# Altium project Clock.PrjPcb
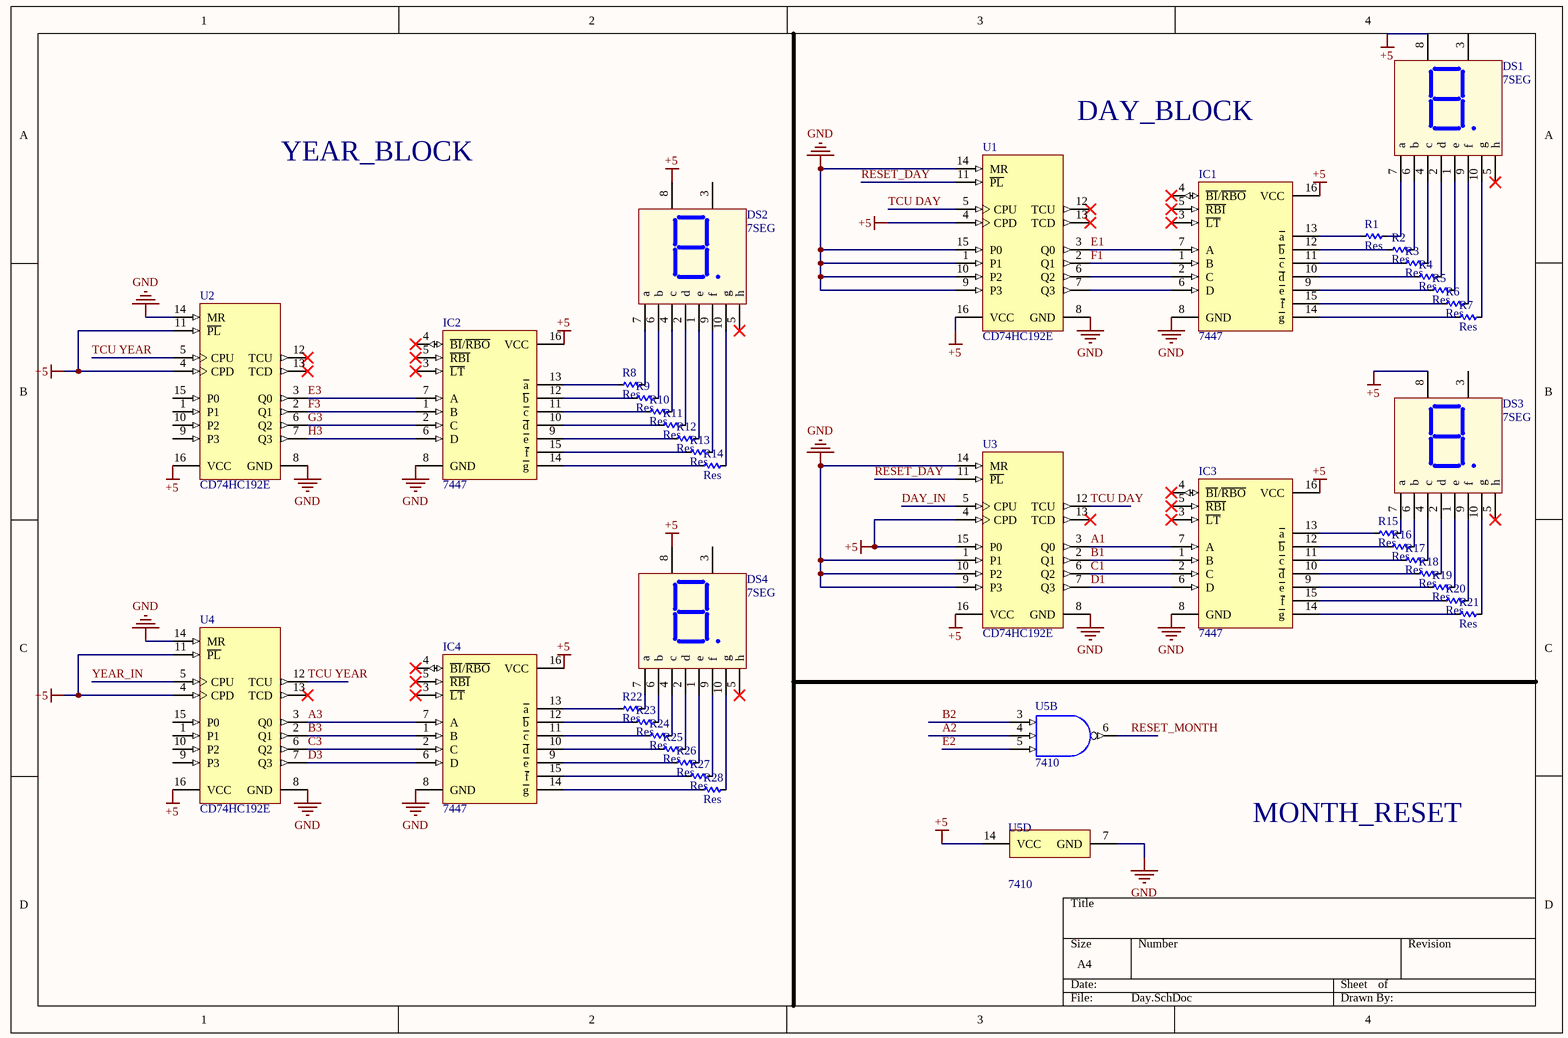
[diagram p0: Day.SchDoc]
3 sheets, 84 parts. Net scope: global (net labels, ports and power ports of the same name join across sheets).
Board file: Clock_pcb.PcbDoc
Sheets:
  Day.SchDoc
  SCH_RESETDAY.SchDoc
  Month.SchDoc

## Sheet Day.SchDoc
size A4; SheetNumber: 1; SheetTotal: 3

### Parts
DS1  7SEG  [LED7SEG-1-0.56]
DS2  7SEG  [LED7SEG-1-0.56]
DS3  7SEG  [LED7SEG-1-0.56]
DS4  7SEG  [LED7SEG-1-0.56]
IC1  7447  [DIP16]
IC2  7447  [DIP16]
IC3  7447  [DIP16]
IC4  7447  [DIP16]
R1  Res  [RES-1/4W]
R2  Res  [RES-1/4W]
R3  Res  [RES-1/4W]
R4  Res  [RES-1/4W]
R5  Res  [RES-1/4W]
R6  Res  [RES-1/4W]
R7  Res  [RES-1/4W]
R8  Res  [RES-1/4W]
R9  Res  [RES-1/4W]
R10  Res  [RES-1/4W]
R11  Res  [RES-1/4W]
R12  Res  [RES-1/4W]
R13  Res  [RES-1/4W]
R14  Res  [RES-1/4W]
R15  Res  [RES-1/4W]
R16  Res  [RES-1/4W]
R17  Res  [RES-1/4W]
R18  Res  [RES-1/4W]
R19  Res  [RES-1/4W]
R20  Res  [RES-1/4W]
R21  Res  [RES-1/4W]
R22  Res  [RES-1/4W]
R23  Res  [RES-1/4W]
R24  Res  [RES-1/4W]
R25  Res  [RES-1/4W]
R26  Res  [RES-1/4W]
R27  Res  [RES-1/4W]
R28  Res  [RES-1/4W]
U1  CD74HC192E  [N0016A]
U2  CD74HC192E  [N0016A]
U3  CD74HC192E  [N0016A]
U4  CD74HC192E  [N0016A]
U5  7410  [N0014A]  (parts B,D of 4)

### Nets
+5: DS1.8(Vcc) DS2.8(Vcc) DS3.8(Vcc) DS4.8(Vcc) IC1.16(VCC) IC2.16(VCC) IC3.16(VCC) IC4.16(VCC) U1.4(CPD) U1.16(VCC) U2.4(CPD) U2.11(~{PL}) U2.16(VCC) U3.4(CPD) U3.15(P0) U3.16(VCC) U4.4(CPD) U4.11(~{PL}) U4.16(VCC) U5.14(VCC)
GND: IC1.8(GND) IC2.8(GND) IC3.8(GND) IC4.8(GND) U1.1(P1) U1.8(GND) U1.9(P3) U1.10(P2) U1.14(MR) U1.15(P0) U2.8(GND) U2.14(MR) U3.1(P1) U3.8(GND) U3.9(P3) U3.10(P2) U3.14(MR) U4.8(GND) U4.14(MR) U5.7(GND)
A1: IC3.7(A) U3.3(Q0)
A2: U5.4(2B)
A3: IC4.7(A) U4.3(Q0)
B1: IC3.1(B) U3.2(Q1)
B2: U5.3(2A)
B3: IC4.1(B) U4.2(Q1)
C1: IC3.2(C) U3.6(Q2)
C3: IC4.2(C) U4.6(Q2)
D1: IC3.6(D) U3.7(Q3)
D3: IC4.6(D) U4.7(Q3)
DAY_IN: U3.5(CPU)
E1: IC1.7(A) U1.3(Q0)
E2: U5.5(2C)
E3: IC2.7(A) U2.3(Q0)
F1: IC1.1(B) U1.2(Q1)
F3: IC2.1(B) U2.2(Q1)
G3: IC2.2(C) U2.6(Q2)
H3: IC2.6(D) U2.7(Q3)
RESET_DAY: U1.11(~{PL}) U3.11(~{PL})
RESET_MONTH: U5.6(2Y)
TCU DAY: U1.5(CPU) U3.12(TCU)
TCU YEAR: U2.5(CPU) U4.12(TCU)
YEAR_IN: U4.5(CPU)
NetDS1_1: DS1.1(e) R5.1
NetDS1_2: DS1.2(d) R4.1
NetDS1_4: DS1.4(c) R3.1
NetDS1_6: DS1.6(b) R2.1
NetDS1_7: DS1.7(a) R1.1
NetDS1_9: DS1.9(f) R6.1
NetDS1_10: DS1.10(g) R7.1
NetDS2_1: DS2.1(e) R12.1
NetDS2_2: DS2.2(d) R11.1
NetDS2_4: DS2.4(c) R10.1
NetDS2_6: DS2.6(b) R9.1
NetDS2_7: DS2.7(a) R8.1
NetDS2_9: DS2.9(f) R13.1
NetDS2_10: DS2.10(g) R14.1
NetDS3_1: DS3.1(e) R19.1
NetDS3_2: DS3.2(d) R18.1
NetDS3_4: DS3.4(c) R17.1
NetDS3_6: DS3.6(b) R16.1
NetDS3_7: DS3.7(a) R15.1
NetDS3_9: DS3.9(f) R20.1
NetDS3_10: DS3.10(g) R21.1
NetDS4_1: DS4.1(e) R26.1
NetDS4_2: DS4.2(d) R25.1
NetDS4_4: DS4.4(c) R24.1
NetDS4_6: DS4.6(b) R23.1
NetDS4_7: DS4.7(a) R22.1
NetDS4_9: DS4.9(f) R27.1
NetDS4_10: DS4.10(g) R28.1
NetIC1_2: IC1.2(C) U1.6(Q2)
NetIC1_6: IC1.6(D) U1.7(Q3)
NetIC1_9: IC1.9(~{e}) R5.2
NetIC1_10: IC1.10(~{d}) R4.2
NetIC1_11: IC1.11(~{c}) R3.2
NetIC1_12: IC1.12(~{b}) R2.2
NetIC1_13: IC1.13(~{a}) R1.2
NetIC1_14: IC1.14(~{g}) R7.2
NetIC1_15: IC1.15(~{f}) R6.2
NetIC2_9: IC2.9(~{e}) R12.2
NetIC2_10: IC2.10(~{d}) R11.2
NetIC2_11: IC2.11(~{c}) R10.2
NetIC2_12: IC2.12(~{b}) R9.2
NetIC2_13: IC2.13(~{a}) R8.2
NetIC2_14: IC2.14(~{g}) R14.2
NetIC2_15: IC2.15(~{f}) R13.2
NetIC3_9: IC3.9(~{e}) R19.2
NetIC3_10: IC3.10(~{d}) R18.2
NetIC3_11: IC3.11(~{c}) R17.2
NetIC3_12: IC3.12(~{b}) R16.2
NetIC3_13: IC3.13(~{a}) R15.2
NetIC3_14: IC3.14(~{g}) R21.2
NetIC3_15: IC3.15(~{f}) R20.2
NetIC4_9: IC4.9(~{e}) R26.2
NetIC4_10: IC4.10(~{d}) R25.2
NetIC4_11: IC4.11(~{c}) R24.2
NetIC4_12: IC4.12(~{b}) R23.2
NetIC4_13: IC4.13(~{a}) R22.2
NetIC4_14: IC4.14(~{g}) R28.2
NetIC4_15: IC4.15(~{f}) R27.2

Not connected (* = marked no-connect by the designer): DS1 3(Vcc) 5(h)*; DS2 3(Vcc) 5(h)*; DS3 3(Vcc) 5(h)*; DS4 3(Vcc) 5(h)*; IC1 3(~{LT})* 4(~{BI}/~{RBO})* 5(~{RBI})*; IC2 3(~{LT})* 4(~{BI}/~{RBO})* 5(~{RBI})*; IC3 3(~{LT})* 4(~{BI}/~{RBO})* 5(~{RBI})*; IC4 3(~{LT})* 4(~{BI}/~{RBO})* 5(~{RBI})*; U1 12(TCU)* 13(TCD)*; U2 1(P1) 9(P3) 10(P2) 12(TCU)* 13(TCD)* 15(P0); U3 13(TCD)*; U4 1(P1) 9(P3) 10(P2) 13(TCD)* 15(P0)

### Notes on the sheet
- YEAR_BLOCK
- DAY_BLOCK
- MONTH_RESET

### Library data of the parts
DS1-DS4 = LED7SEG-1: 14.2 mm General Purpose Blue 7-Segment Display: CC, RH DP, Gray Surface; MinimumIntensity: 2020 ucd; Note: IF = 10 mA; Published: 8-Jun-2000; LatestRevisionDate: 17-Dec-2003; LatestRevisionNote: Schematic revised, PCB Footprint replaced.; DatasheetDocument: 24-Sep-2002; PackageDocument: 24-Sep-2002; PackageReference: H; Publisher: Altium Limited; Colour: Blue; ComponentLink1Description: Manufacturer Link; ComponentLink1URL: http://www.agilent.com/
IC1-IC4 = 7447: BCD to 7-Segment Decoder/Driver; Value: 7447 , 74247
R1-R28 = Res: Manufacturer: Generic Components; Class: Passive; SubClass: R; Published: 08/06/2000; Publisher: Altium Hobart Technology Centre
U1-U4 = 74192: High Speed CMOS Logic Presettable Synchronous BCD Decade Up/Down Counter with Asynchronous Reset, N0016A, TUBE; Manufacturer: Texas Instruments; Output Drive (IOL/IOH)(Max)(mA): 5.2/-5.2; Inputs: 1; VCC(Min)(V): 2; ICC @ Nom Voltage(Max)(mA): 0.08; Input Type: LVTTL/CMOS; Technology Family: HC; F @ Nom Voltage(Max)(Mhz): 28; VCC(Max)(V): 6; Bits(#): 4; Rating: Catalog; tpd @ Nom Voltage(Max)(ns): 46; Voltage(Nom)(V): 3.3,5; Schmitt Trigger: No; PackageReference: N0016A; Code_JEDEC: MS-001; Generic Part Number: CD74HC192; Type: Decade; DatasheetVersion: SCHS163F; Operating Temperature Range(C): -55 to 125; Function: Counter; Output Type: CMOS
U5 = 7410: Triple 3-input positive-NAND gates, N0014A, TUBE; Manufacturer: Texas Instruments; Generic Part Number: SN74F10; Input Type: TTL; F @ Nom Voltage(Max)(Mhz): 70; Schmitt Trigger: No; tpd @ Nom Voltage(Max)(ns): 6; Bits(#): 3; Rating: Catalog; VCC(Max)(V): 5.5; ICC @ Nom Voltage(Max)(mA): 0.0077; Output Drive (IOL/IOH)(Max)(mA): 1/-20; Technology Family: F; VCC(Min)(V): 4.5; Voltage(Nom)(V): 5; DatasheetVersion: SDFS039A; Output Type: TTL; Code_JEDEC: MS-001; Operating Temperature Range(C): 0 to 70; PackageReference: N0014A

## Sheet SCH_RESETDAY.SchDoc
size A4; SheetNumber: 2; SheetTotal: 3
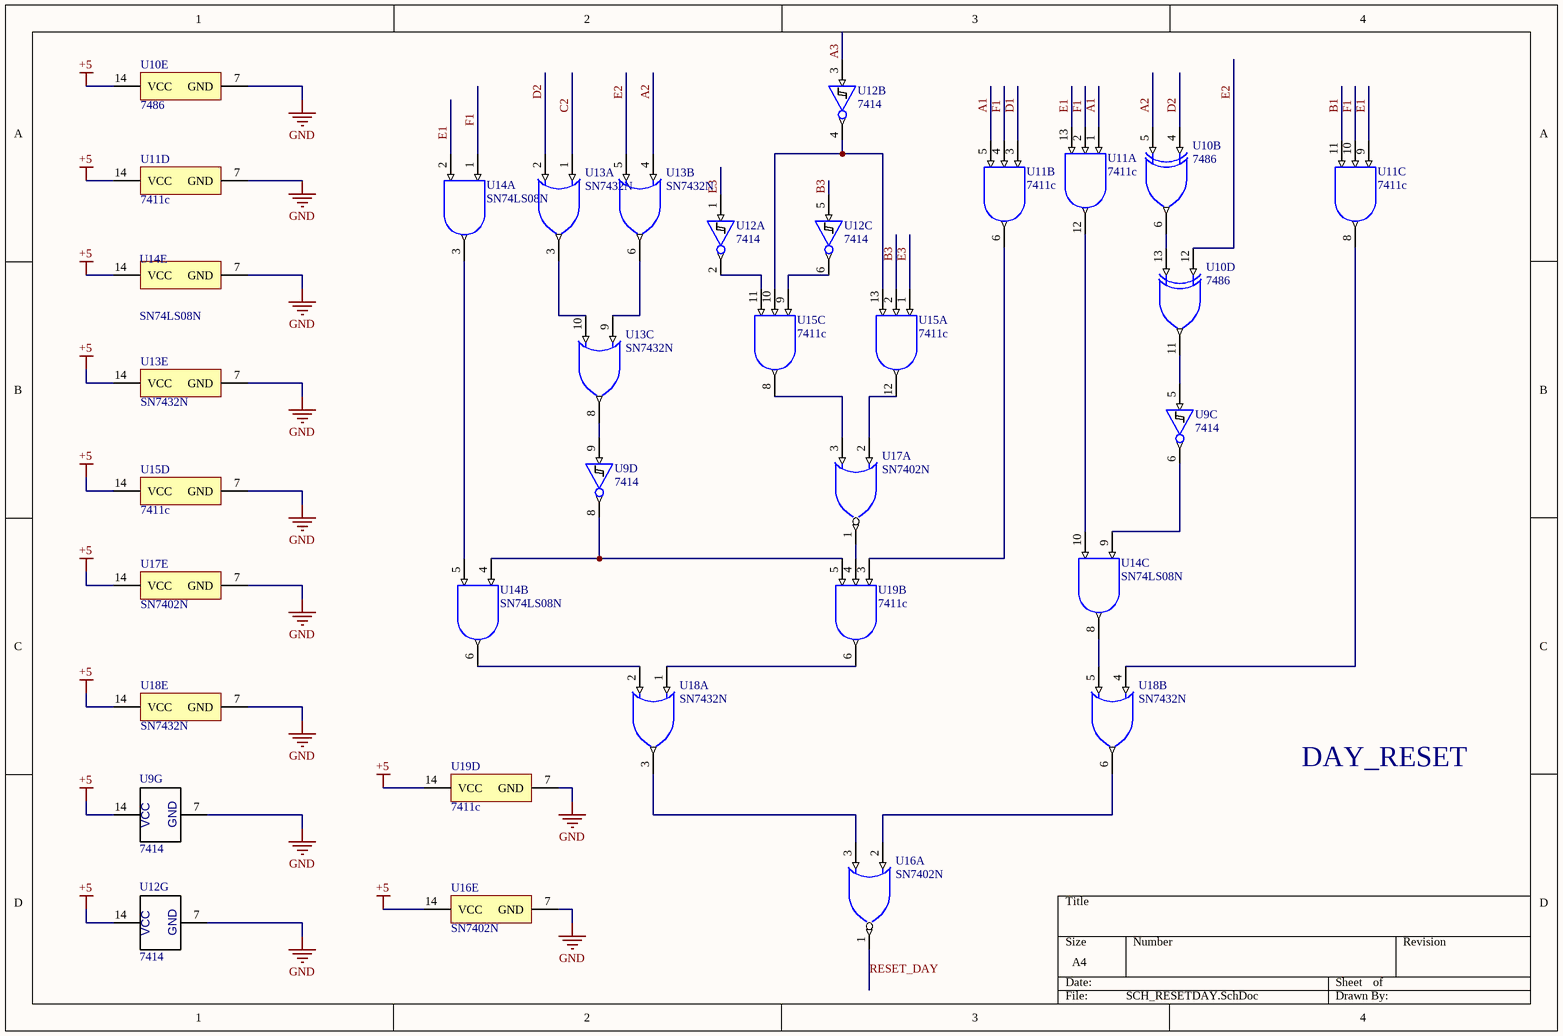
[diagram p1: SCH_RESETDAY.SchDoc]

### Parts
U9  7414  [DIP14]  (parts C,D,G of 7)
U10  7486  [N0014A]  (parts B,D,E of 5)
U11  7411c  [N0014A]  (parts A,B,C,D of 4)
U12  7414  [DIP14]  (parts A,B,C,G of 7)
U13  SN7432N  [N0014A]  (parts A,B,C,E of 5)
U14  SN74LS08N  [N0014A]  (parts A,B,C,E of 5)
U15  7411c  [N0014A]  (parts A,C,D of 4)
U16  SN7402N  [N0014A]  (parts A,E of 5)
U17  SN7402N  [N0014A]  (parts A,E of 5)
U18  SN7432N  [N0014A]  (parts A,B,E of 5)
U19  7411c  [N0014A]  (parts B,D of 4)

### Nets
+5: U9.14(VCC) U10.14(VCC) U11.14(VCC) U12.14(VCC) U13.14(VCC) U14.14(VCC) U15.14(VCC) U16.14(VCC) U17.14(VCC) U18.14(VCC) U19.14(VCC)
GND: U9.7(GND) U10.7(GND) U11.7(GND) U12.7(GND) U13.7(GND) U14.7(GND) U15.7(GND) U16.7(GND) U17.7(GND) U18.7(GND) U19.7(GND)
A1: U11.1(1A) U11.5(2C)
A2: U10.5(2B) U13.4(2A)
A3: U12.3(A)
B1: U11.11(3C)
B3: U12.5(A) U15.2(1B)
C2: U13.1(1A)
D1: U11.3(2A)
D2: U10.4(2A) U13.2(1B)
E1: U11.9(3A) U11.13(1C) U14.2(1B)
E2: U10.12(4A) U13.5(2B)
E3: U12.1(A) U15.1(1A)
F1: U11.2(1B) U11.4(2B) U11.10(3B) U14.1(1A)
RESET_DAY: U16.1(1Y)
NetU9_5: U9.5(A) U10.11(4Y)
NetU9_6: U9.6(Y) U14.9(3A)
NetU9_8: U9.8(Y) U14.4(2A) U19.5(2C)
NetU9_9: U9.9(A) U13.8(3Y)
NetU10_6: U10.6(2Y) U10.13(4B)
NetU11_6: U11.6(2Y) U19.3(2A)
NetU11_8: U11.8(3Y) U18.4(2A)
NetU11_12: U11.12(1Y) U14.10(3B)
NetU12_2: U12.2(Y) U15.11(3C)
NetU12_4: U12.4(Y) U15.10(3B) U15.13(1C)
NetU12_6: U12.6(Y) U15.9(3A)
NetU13_3: U13.3(1Y) U13.10(3B)
NetU13_6: U13.6(2Y) U13.9(3A)
NetU14_3: U14.3(1Y) U14.5(2B)
NetU14_6: U14.6(2Y) U18.2(1B)
NetU14_8: U14.8(3Y) U18.5(2B)
NetU15_8: U15.8(3Y) U17.3(1B)
NetU15_12: U15.12(1Y) U17.2(1A)
NetU16_2: U16.2(1A) U18.6(2Y)
NetU16_3: U16.3(1B) U18.3(1Y)
NetU17_1: U17.1(1Y) U19.4(2B)
NetU18_1: U18.1(1A) U19.6(2Y)

### Notes on the sheet
- DAY_RESET

### Library data of the parts
U9 U12 = 7414: IC, M74HC04M, Hex Inverter, SO-14; Text Field1: ST; Text Field2: M74HC04M1R; Text Field3: Mouser; Text Field4: 511-M74HC04M; Text Field6: .22; Text Field5: SO-14; NI?: *; O?: *; Section:: *
U10 = 7486: High Speed CMOS Logic Quad 2-Input Exclusive-OR Gates, N0014A, TUBE; Manufacturer: Texas Instruments; Generic Part Number: CD74HC86; tpd @ Nom Voltage(Max)(ns): 30; Rating: Catalog; F @ Nom Voltage(Max)(Mhz): 70; VCC(Max)(V): 6; ICC @ Nom Voltage(Max)(mA): 0.02; VCC(Min)(V): 2; Voltage(Nom)(V): 5; Technology Family: HC; Schmitt Trigger: No; Output Drive (IOL/IOH)(Max)(mA): 5.2/-5.2; Bits(#): 4; Output Type: CMOS; DatasheetVersion: SCHS137D; Input Type: CMOS; PackageReference: N0014A; Operating Temperature Range(C): -55 to 125
U11 U15 U19 = 7411c: High Speed CMOS Logic Triple 3-Input AND Gates, N0014A, TUBE; Generic Part Number: CD74HC11; Manufacturer: Texas Instruments; tpd @ Nom Voltage(Max)(ns): 25; VCC(Max)(V): 6; Rating: Catalog; Technology Family: HC; Schmitt Trigger: No; ICC @ Nom Voltage(Max)(mA): 0.02; Bits(#): 3; Voltage(Nom)(V): 5; Output Drive (IOL/IOH)(Max)(mA): -5.2/5.2; VCC(Min)(V): 2; F @ Nom Voltage(Max)(Mhz): 70; DatasheetVersion: SCHS273E; Input Type: CMOS; PackageReference: N0014A; Output Type: CMOS; Operating Temperature Range(C): -55 to 125
U13 U18 = CMP-1573-00140-3: Quad 2-input positive-OR gates, N0014A, TUBE; Manufacturer: Texas Instruments; Generic Part Number: SN7432; VCC(Max)(V): 5.25; Voltage(Nom)(V): 5; VCC(Min)(V): 4.75; F @ Nom Voltage(Max)(Mhz): 100; Output Type: TTL; Output Drive (IOL/IOH)(Max)(mA): 0.8/-16; ICC @ Nom Voltage(Max)(mA): 0.038; Bits(#): 4; tpd @ Nom Voltage(Max)(ns): 22; Rating: Catalog; PackageVersion: http://www.ti.com/lit/ml/mpdi002c/mpdi002c.pdf; Operating Temperature Range(C): 0 to 70; DatasheetVersion: SDLS100; Code_JEDEC: MS-001; Input Type: TTL; PackageReference: N0014A
U14 = CMP-0777-00259-3: Quadruple 2-Input Positive-AND Gates, N0014A, TUBE; Manufacturer: Texas Instruments; VCC(Max)(V): 5.25; ICC @ Nom Voltage(Max)(mA): 0.021; VCC(Min)(V): 4.75; tpd @ Nom Voltage(Max)(ns): 25; Rating: Catalog; Output Type: TTL; Bits(#): 4; Schmitt Trigger: No; Voltage(Nom)(V): 5; Technology Family: LS; F @ Nom Voltage(Max)(Mhz): 35; Output Drive (IOL/IOH)(Max)(mA): -0.8/16; PackageReference: N0014A; DatasheetVersion: SDLS033; Input Type: TTL; Operating Temperature Range(C): 0 to 70; Generic Part Number: SN74LS08
U16 U17 = CMP-0806-00203-3: Quad 2-input Positive-NOR gates, N0014A, TUBE; Generic Part Number: SN7402; Manufacturer: Texas Instruments; Input Type: TTL; F @ Nom Voltage(Max)(Mhz): 75; VCC(Max)(V): 5.25; VCC(Min)(V): 4.75; Voltage(Nom)(V): 5; Rating: Catalog; Bits(#): 4; ICC @ Nom Voltage(Max)(mA): 0.027; Output Drive (IOL/IOH)(Max)(mA): 0.8/-16; tpd @ Nom Voltage(Max)(ns): 22; Code_JEDEC: MS-001; PackageVersion: http://www.ti.com/lit/ml/mpdi002c/mpdi002c.pdf; Operating Temperature Range(C): 0 to 70; Output Type: TTL; PackageReference: N0014A; DatasheetVersion: SDLS027

## Sheet Month.SchDoc
size A4; SheetNumber: 3; SheetTotal: 3
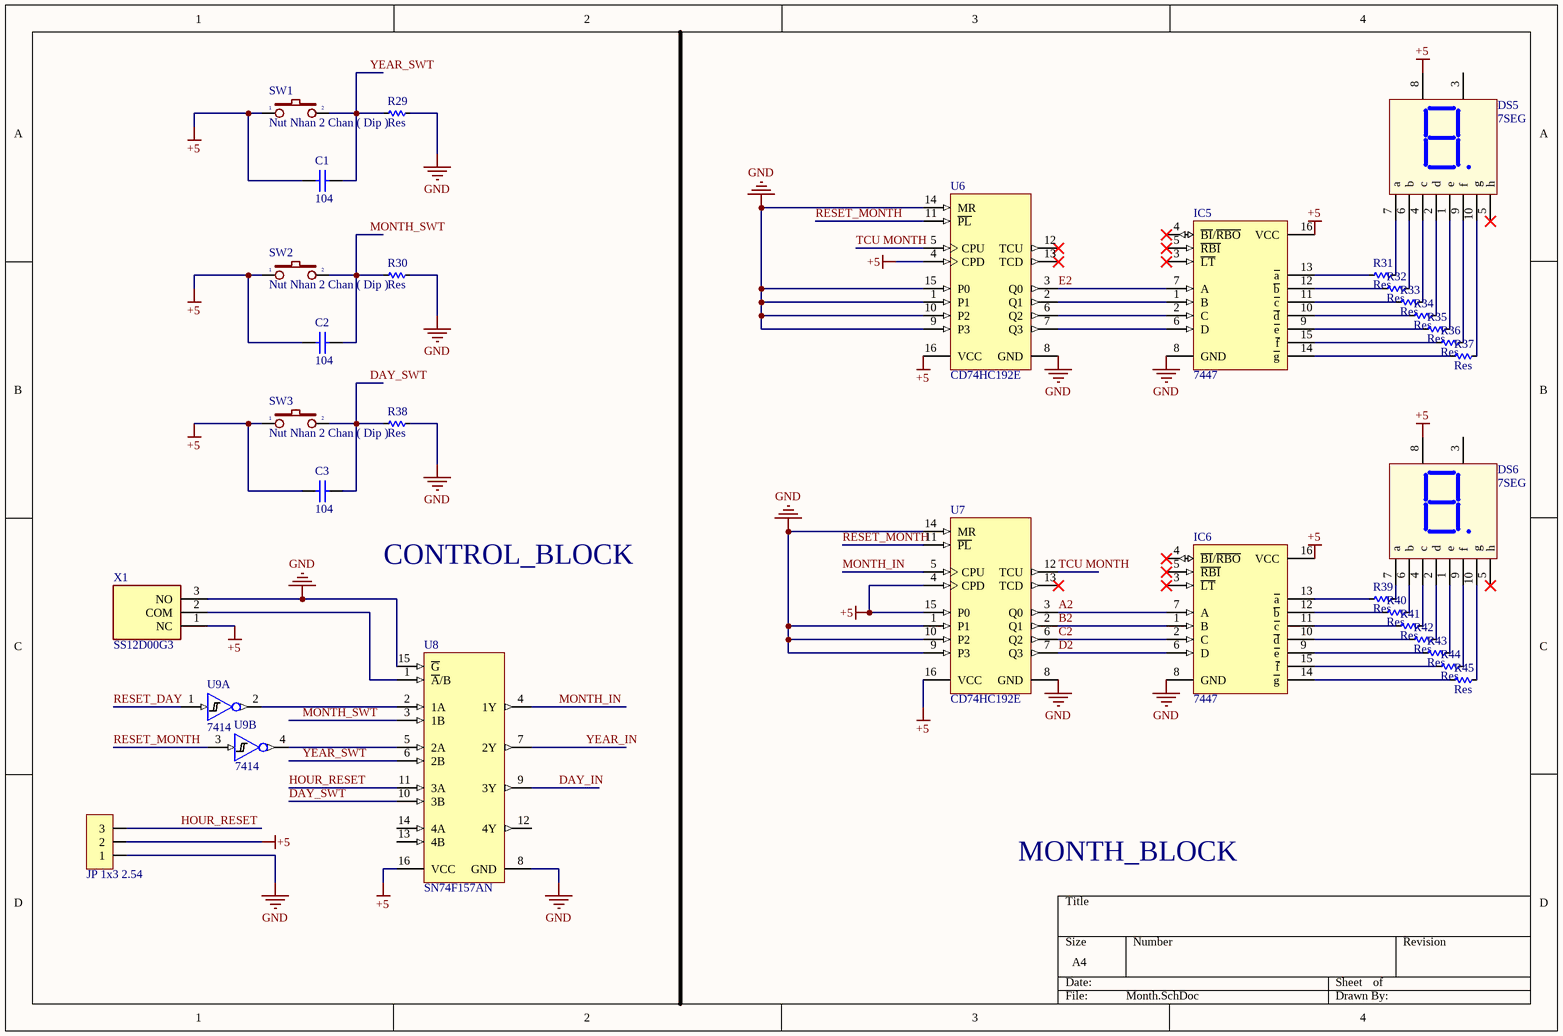
[diagram p2: Month.SchDoc]

### Parts
C1  104  [tu gom]
C2  104  [tu gom]
C3  104  [tu gom]
DS5  7SEG  [LED7SEG-1-0.56]
DS6  7SEG  [LED7SEG-1-0.56]
IC5  7447  [DIP16]
IC6  7447  [DIP16]
JP1  JP 1x3 2.54  [JP 1x3 CT]
R29  Res  [RES-1/4W]
R30  Res  [RES-1/4W]
R31  Res  [RES-1/4W]
R32  Res  [RES-1/4W]
R33  Res  [RES-1/4W]
R34  Res  [RES-1/4W]
R35  Res  [RES-1/4W]
R36  Res  [RES-1/4W]
R37  Res  [RES-1/4W]
R38  Res  [RES-1/4W]
R39  Res  [RES-1/4W]
R40  Res  [RES-1/4W]
R41  Res  [RES-1/4W]
R42  Res  [RES-1/4W]
R43  Res  [RES-1/4W]
R44  Res  [RES-1/4W]
R45  Res  [RES-1/4W]
SW1  Nut Nhan 2 Chan ( Dip )  [SW2]
SW2  Nut Nhan 2 Chan ( Dip )  [SW2]
SW3  Nut Nhan 2 Chan ( Dip )  [SW2]
U6  CD74HC192E  [N0016A]
U7  CD74HC192E  [N0016A]
U8  SN74F157AN  [N0016A]
U9  7414  [DIP14]  (parts A,B of 7)
X1  SS12D00G3  [SS12D00G3]

### Nets
+5: C1.2 C2.2 C3.2 DS5.8(Vcc) DS6.8(Vcc) IC5.16(VCC) IC6.16(VCC) JP1.2 SW1.1 SW2.1 SW3.1 U6.4(CPD) U6.16(VCC) U7.4(CPD) U7.15(P0) U7.16(VCC) U8.16(VCC) X1.1(NC)
GND: IC5.8(GND) IC6.8(GND) JP1.1 R29.1 R30.1 R38.1 U6.1(P1) U6.8(GND) U6.9(P3) U6.10(P2) U6.14(MR) U6.15(P0) U7.1(P1) U7.8(GND) U7.9(P3) U7.10(P2) U7.14(MR) U8.8(GND) U8.15(~{G}) X1.3(NO)
A2: IC6.7(A) U7.3(Q0)
B2: IC6.1(B) U7.2(Q1)
C2: IC6.2(C) U7.6(Q2)
D2: IC6.6(D) U7.7(Q3)
DAY_IN: U8.9(3Y)
DAY_SWT: C3.1 R38.2 SW3.2 U8.10(3B)
E2: IC5.7(A) U6.3(Q0)
HOUR_RESET: JP1.3 U8.11(3A)
MONTH_IN: U7.5(CPU) U8.4(1Y)
MONTH_SWT: C2.1 R30.2 SW2.2 U8.3(1B)
RESET_DAY: U9.1(A)
RESET_MONTH: U6.11(~{PL}) U7.11(~{PL}) U9.3(A)
TCU MONTH: U6.5(CPU) U7.12(TCU)
YEAR_IN: U8.7(2Y)
YEAR_SWT: C1.1 R29.2 SW1.2 U8.6(2B)
NetDS5_1: DS5.1(e) R35.1
NetDS5_2: DS5.2(d) R34.1
NetDS5_4: DS5.4(c) R33.1
NetDS5_6: DS5.6(b) R32.1
NetDS5_7: DS5.7(a) R31.1
NetDS5_9: DS5.9(f) R36.1
NetDS5_10: DS5.10(g) R37.1
NetDS6_1: DS6.1(e) R43.1
NetDS6_2: DS6.2(d) R42.1
NetDS6_4: DS6.4(c) R41.1
NetDS6_6: DS6.6(b) R40.1
NetDS6_7: DS6.7(a) R39.1
NetDS6_9: DS6.9(f) R44.1
NetDS6_10: DS6.10(g) R45.1
NetIC5_1: IC5.1(B) U6.2(Q1)
NetIC5_2: IC5.2(C) U6.6(Q2)
NetIC5_6: IC5.6(D) U6.7(Q3)
NetIC5_9: IC5.9(~{e}) R35.2
NetIC5_10: IC5.10(~{d}) R34.2
NetIC5_11: IC5.11(~{c}) R33.2
NetIC5_12: IC5.12(~{b}) R32.2
NetIC5_13: IC5.13(~{a}) R31.2
NetIC5_14: IC5.14(~{g}) R37.2
NetIC5_15: IC5.15(~{f}) R36.2
NetIC6_9: IC6.9(~{e}) R43.2
NetIC6_10: IC6.10(~{d}) R42.2
NetIC6_11: IC6.11(~{c}) R41.2
NetIC6_12: IC6.12(~{b}) R40.2
NetIC6_13: IC6.13(~{a}) R39.2
NetIC6_14: IC6.14(~{g}) R45.2
NetIC6_15: IC6.15(~{f}) R44.2
NetU8_1: U8.1(~{A}/B) X1.2(COM)
NetU8_2: U8.2(1A) U9.2(Y)
NetU8_5: U8.5(2A) U9.4(Y)

Not connected (* = marked no-connect by the designer): DS5 3(Vcc) 5(h)*; DS6 3(Vcc) 5(h)*; IC5 3(~{LT})* 4(~{BI}/~{RBO})* 5(~{RBI})*; IC6 3(~{LT})* 4(~{BI}/~{RBO})* 5(~{RBI})*; U6 12(TCU)* 13(TCD)*; U7 13(TCD)*; U8 12(4Y) 13(4B) 14(4A)

### Notes on the sheet
- CONTROL_BLOCK
- MONTH_BLOCK

### Library data of the parts
C1-C3 = Tu gom 104 50V: Cắm; So_Chan: 2; Ten_Linh_Kien: Tụ gốm 104 100nF 50V; Don_Vi: Con; Ma_Hang: MH004761; Chung_Loai: Cắm; Kieu_Chan: *
DS5 DS6 = LED7SEG-1: as DS1 on sheet Day; Published: 8-Jun-2000; LatestRevisionDate: 17-Dec-2003; LatestRevisionNote: Schematic revised, PCB Footprint replaced.; DatasheetDocument: 24-Sep-2002; PackageDocument: 24-Sep-2002; PackageReference: H; Publisher: Altium Limited; Colour: Blue; ComponentLink1Description: Manufacturer Link; ComponentLink1URL: http://www.agilent.com/
IC5 IC6 = 7447: as IC1 on sheet Day
JP1 = JP 1x3 2.54 Cai Thang: Cắm; Ten_Linh_Kien: Jump Đơn Cái 2.54MM 1x20P Thẳng; Don_Vi: Con; Ma_Hang: MH004006; Ghi_Chu: *; Kieu_Chan: *; Chung_Loai: Cắm
R29-R45 = Res: as R1 on sheet Day; Published: 08/06/2000; Publisher: Altium Hobart Technology Centre
SW1-SW3 = Nut Nhan 2 Chan ( Dip ): Cắm; Ten_Linh_Kien: Nút Nhấn 2 Chân 6x6x5MM DIP; Ma_Hang: MH001959; Don_Vi: Con; Kieu_Chan: *; Ghi_Chu: *; Chung_Loai: Cắm
U6 U7 = 74192: as U1 on sheet Day; PackageReference: N0016A; Code_JEDEC: MS-001; Generic Part Number: CD74HC192; Type: Decade; DatasheetVersion: SCHS163F; Operating Temperature Range(C): -55 to 125; Function: Counter; Output Type: CMOS
U8 = CMP-1633-00611-2: Quadruple 2-Line To 1-Line Data Selectors/Multiplexers, N0016A, TUBE; Manufacturer: Texas Instruments; Channels(#): 4; F @ Nom Voltage(Max)(Mhz): 70; Schmitt Trigger: No; Configuration: 2：1; Voltage(Nom)(V): 5; VCC(Min)(V): 4.5; tpd @ Nom Voltage(Max)(ns): 11; Rating: Catalog; VCC(Max)(V): 5.5; Technology Family: F; ICC @ Nom Voltage(Max)(mA): 23; Function: Encoder/Multiplexer; Output Drive (IOL/IOH)(Max)(mA): 20/-1; DatasheetVersion: SDFS053A; Operating Temperature Range(C): 0 to 70; Code_JEDEC: MS-001; Generic Part Number: SN74F157A; Type: Standard; PackageReference: N0016A
U9 = 7414: as U9 on sheet SCH_RESETDAY; Text Field5: SO-14; NI?: *; O?: *; Section:: *
X1 = SS12D00G3: 3 Pin Toggle Switch; Manufacturer_Name: Vimex; Geometry.Height: 7mm; Manufacturer_Part_Number: SS12D00G3; Mouser Part Number: *; Mouser Price/Stock: *; Arrow Part Number: *; Arrow Price/Stock: *; Datasheet Link: http://vimex.com/switches/techdocs/SS12D00-tech.pdf

## Nets that join several sheets
+5: Day (20 pins), SCH_RESETDAY (11 pins), Month (18 pins)
GND: Day (20 pins), SCH_RESETDAY (11 pins), Month (20 pins)
A1: Day (IC3.7 U3.3), SCH_RESETDAY (U11.1 U11.5)
A2: Day (U5.4), SCH_RESETDAY (U10.5 U13.4), Month (IC6.7 U7.3)
A3: Day (IC4.7 U4.3), SCH_RESETDAY (U12.3)
B1: Day (IC3.1 U3.2), SCH_RESETDAY (U11.11)
B2: Day (U5.3), Month (IC6.1 U7.2)
B3: Day (IC4.1 U4.2), SCH_RESETDAY (U12.5 U15.2)
C2: SCH_RESETDAY (U13.1), Month (IC6.2 U7.6)
D1: Day (IC3.6 U3.7), SCH_RESETDAY (U11.3)
D2: SCH_RESETDAY (U10.4 U13.2), Month (IC6.6 U7.7)
DAY_IN: Day (U3.5), Month (U8.9)
E1: Day (IC1.7 U1.3), SCH_RESETDAY (U11.9 U11.13 U14.2)
E2: Day (U5.5), SCH_RESETDAY (U10.12 U13.5), Month (IC5.7 U6.3)
E3: Day (IC2.7 U2.3), SCH_RESETDAY (U12.1 U15.1)
F1: Day (IC1.1 U1.2), SCH_RESETDAY (U11.2 U11.4 U11.10 U14.1)
RESET_DAY: Day (U1.11 U3.11), SCH_RESETDAY (U16.1), Month (U9.1)
RESET_MONTH: Day (U5.6), Month (U6.11 U7.11 U9.3)
YEAR_IN: Day (U4.5), Month (U8.7)